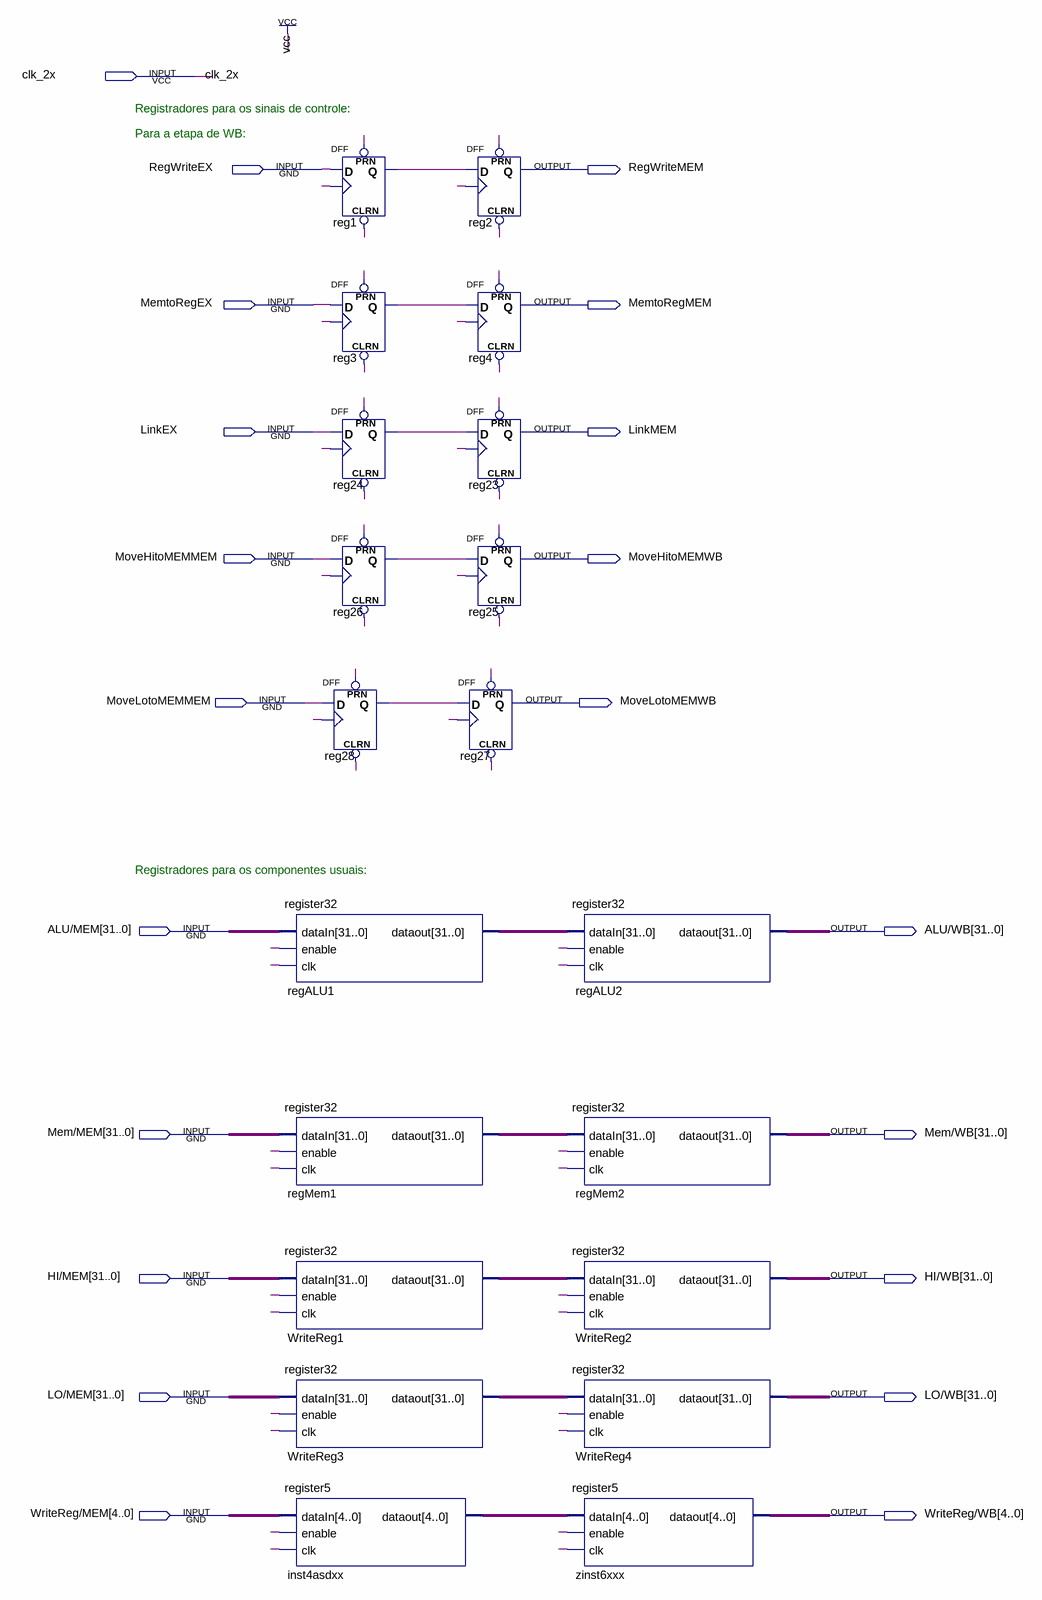
[diagram p0: schematic sheet]
// Quartus schematic registerMEMWB.bdf as structural Verilog: 20 symbols, 21 pins
module registerMEMWB (
  input  clk_2x,
  input  RegWriteEX,
  input  MemtoRegEX,
  input  LinkEX,
  input  MoveHitoMEMMEM,
  input  MoveLotoMEMMEM,
  input  [31:0] \ALU/MEM ,
  input  [31:0] \Mem/MEM ,
  input  [31:0] \HI/MEM ,
  input  [31:0] \LO/MEM ,
  input  [4:0] \WriteReg/MEM ,
  output RegWriteMEM,
  output MemtoRegMEM,
  output LinkMEM,
  output MoveHitoMEMWB,
  output MoveLotoMEMWB,
  output [31:0] \ALU/WB ,
  output [31:0] \Mem/WB ,
  output [31:0] \HI/WB ,
  output [31:0] \LO/WB ,
  output [4:0] \WriteReg/WB 
);

  wire reg1_q, reg3_q, reg24_q, reg26_q, reg28_q;
  wire [4:0] inst4asdxx_dataout;
  wire [31:0] regALU1_dataout, regMem1_dataout, WriteReg1_dataout, WriteReg3_dataout;

  register32 regALU1 (.dataIn(\ALU/MEM ), .enable(1'b1), .clk(clk_2x), .dataout(regALU1_dataout));
  register32 regMem1 (.dataIn(\Mem/MEM ), .enable(1'b1), .clk(clk_2x), .dataout(regMem1_dataout));
  register32 WriteReg1 (.dataIn(\HI/MEM ), .enable(1'b1), .clk(clk_2x), .dataout(WriteReg1_dataout));
  register32 WriteReg3 (.dataIn(\LO/MEM ), .enable(1'b1), .clk(clk_2x), .dataout(WriteReg3_dataout));
  register5 inst4asdxx (.dataIn(\WriteReg/MEM ), .enable(1'b1), .clk(clk_2x), .dataout(inst4asdxx_dataout));
  DFF reg1 (.CLRN(1'b1), .CLK(clk_2x), .D(RegWriteEX), .PRN(1'b1), .Q(reg1_q));
  DFF reg3 (.CLRN(1'b1), .CLK(clk_2x), .D(MemtoRegEX), .PRN(1'b1), .Q(reg3_q));
  DFF reg24 (.CLRN(1'b1), .CLK(clk_2x), .D(LinkEX), .PRN(1'b1), .Q(reg24_q));
  DFF reg26 (.CLRN(1'b1), .CLK(clk_2x), .D(MoveHitoMEMMEM), .PRN(1'b1), .Q(reg26_q));
  DFF reg28 (.CLRN(1'b1), .CLK(clk_2x), .D(MoveLotoMEMMEM), .PRN(1'b1), .Q(reg28_q));
  DFF reg2 (.CLRN(1'b1), .CLK(clk_2x), .D(reg1_q), .PRN(1'b1), .Q(RegWriteMEM));
  DFF reg4 (.CLRN(1'b1), .CLK(clk_2x), .D(reg3_q), .PRN(1'b1), .Q(MemtoRegMEM));
  DFF reg23 (.CLRN(1'b1), .CLK(clk_2x), .D(reg24_q), .PRN(1'b1), .Q(LinkMEM));
  DFF reg25 (.CLRN(1'b1), .CLK(clk_2x), .D(reg26_q), .PRN(1'b1), .Q(MoveHitoMEMWB));
  DFF reg27 (.CLRN(1'b1), .CLK(clk_2x), .D(reg28_q), .PRN(1'b1), .Q(MoveLotoMEMWB));
  register32 regALU2 (.dataIn(regALU1_dataout), .enable(1'b1), .clk(clk_2x), .dataout(\ALU/WB ));
  register32 regMem2 (.dataIn(regMem1_dataout), .enable(1'b1), .clk(clk_2x), .dataout(\Mem/WB ));
  register32 WriteReg2 (.dataIn(WriteReg1_dataout), .enable(1'b1), .clk(clk_2x), .dataout(\HI/WB ));
  register32 WriteReg4 (.dataIn(WriteReg3_dataout), .enable(1'b1), .clk(clk_2x), .dataout(\LO/WB ));
  register5 zinst6xxx (.dataIn(inst4asdxx_dataout), .enable(1'b1), .clk(clk_2x), .dataout(\WriteReg/WB ));

  // Notes on the sheet:
  //   Registradores para os sinais de controle:
  //   Para a etapa de WB:
  //   Registradores para os componentes usuais:
endmodule
